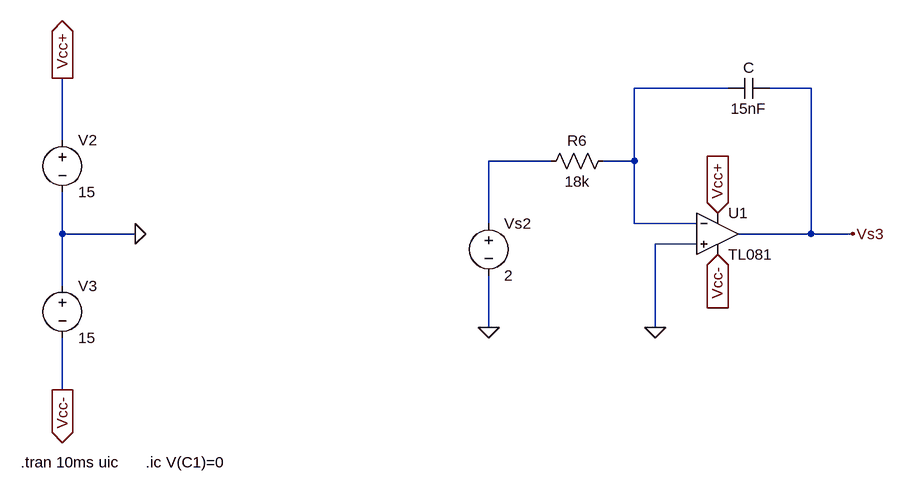
[diagram p0: schematic Boucle_Retroaction_Condensateur.asc]
Boucle_Retroaction_Condensateur.asc, the LTspice schematic file:
Version 4
SHEET 1 880 680
WIRE 384 -80 240 -80
WIRE 512 -80 448 -80
WIRE -640 0 -640 -96
WIRE 112 32 16 32
WIRE 240 32 240 -80
WIRE 240 32 192 32
WIRE 16 128 16 32
WIRE 240 128 240 32
WIRE 336 128 240 128
WIRE -640 144 -640 80
WIRE -528 144 -640 144
WIRE 512 144 512 -80
WIRE 512 144 400 144
WIRE 576 144 512 144
WIRE 336 160 272 160
WIRE -640 224 -640 144
WIRE 16 288 16 208
WIRE 272 288 272 160
WIRE -640 384 -640 304
FLAG 272 288 0
FLAG 16 288 0
FLAG 576 144 Vs3
FLAG -528 144 0
FLAG -640 -96 Vcc+
IOPIN -640 -96 Out
FLAG -640 384 Vcc-
IOPIN -640 384 Out
FLAG 368 112 Vcc+
IOPIN 368 112 In
FLAG 368 176 Vcc-
IOPIN 368 176 In
SYMBOL voltage 16 112 R0
SYMATTR InstName Vs2
SYMATTR Value 2
SYMBOL res 208 16 R90
WINDOW 0 0 56 VBottom 2
WINDOW 3 32 56 VTop 2
SYMATTR InstName R6
SYMATTR Value 18k
SYMBOL cap 448 -96 R90
WINDOW 0 0 32 VBottom 2
WINDOW 3 32 32 VTop 2
SYMATTR InstName C
SYMATTR Value 15nF
SYMBOL TL081 368 80 R0
SYMATTR InstName U1
SYMBOL voltage -640 -16 R0
SYMATTR InstName V2
SYMATTR Value 15
SYMBOL voltage -640 208 R0
WINDOW 123 0 0 Left 0
WINDOW 39 0 0 Left 0
SYMATTR InstName V3
SYMATTR Value 15
TEXT -704 496 Left 2 !.tran 10ms uic
TEXT -512 496 Left 2 !.ic V(C1)=0

The netlist it stands for:
* Boucle_Retroaction_Condensateur.asc
Vs2 N002 0 2
R6 N001 N002 18k
C Vs3 N001 15nF
* U1: TL081 (symbol TL081 not available, pins judged from their places): In+=0 In-=N001 V+=Vcc+ V-=Vcc- OUT=Vs3
V2 Vcc+ 0 15
V3 0 Vcc- 15
.tran 10ms uic
.ic V(C1)=0
.backanno
.end